# EAGLE design bbqsensor (EAGLE 9.6.2)
COMPANY: ADAFRUIT INDUSTRIES; DRAWN: KTOWN; REV: A
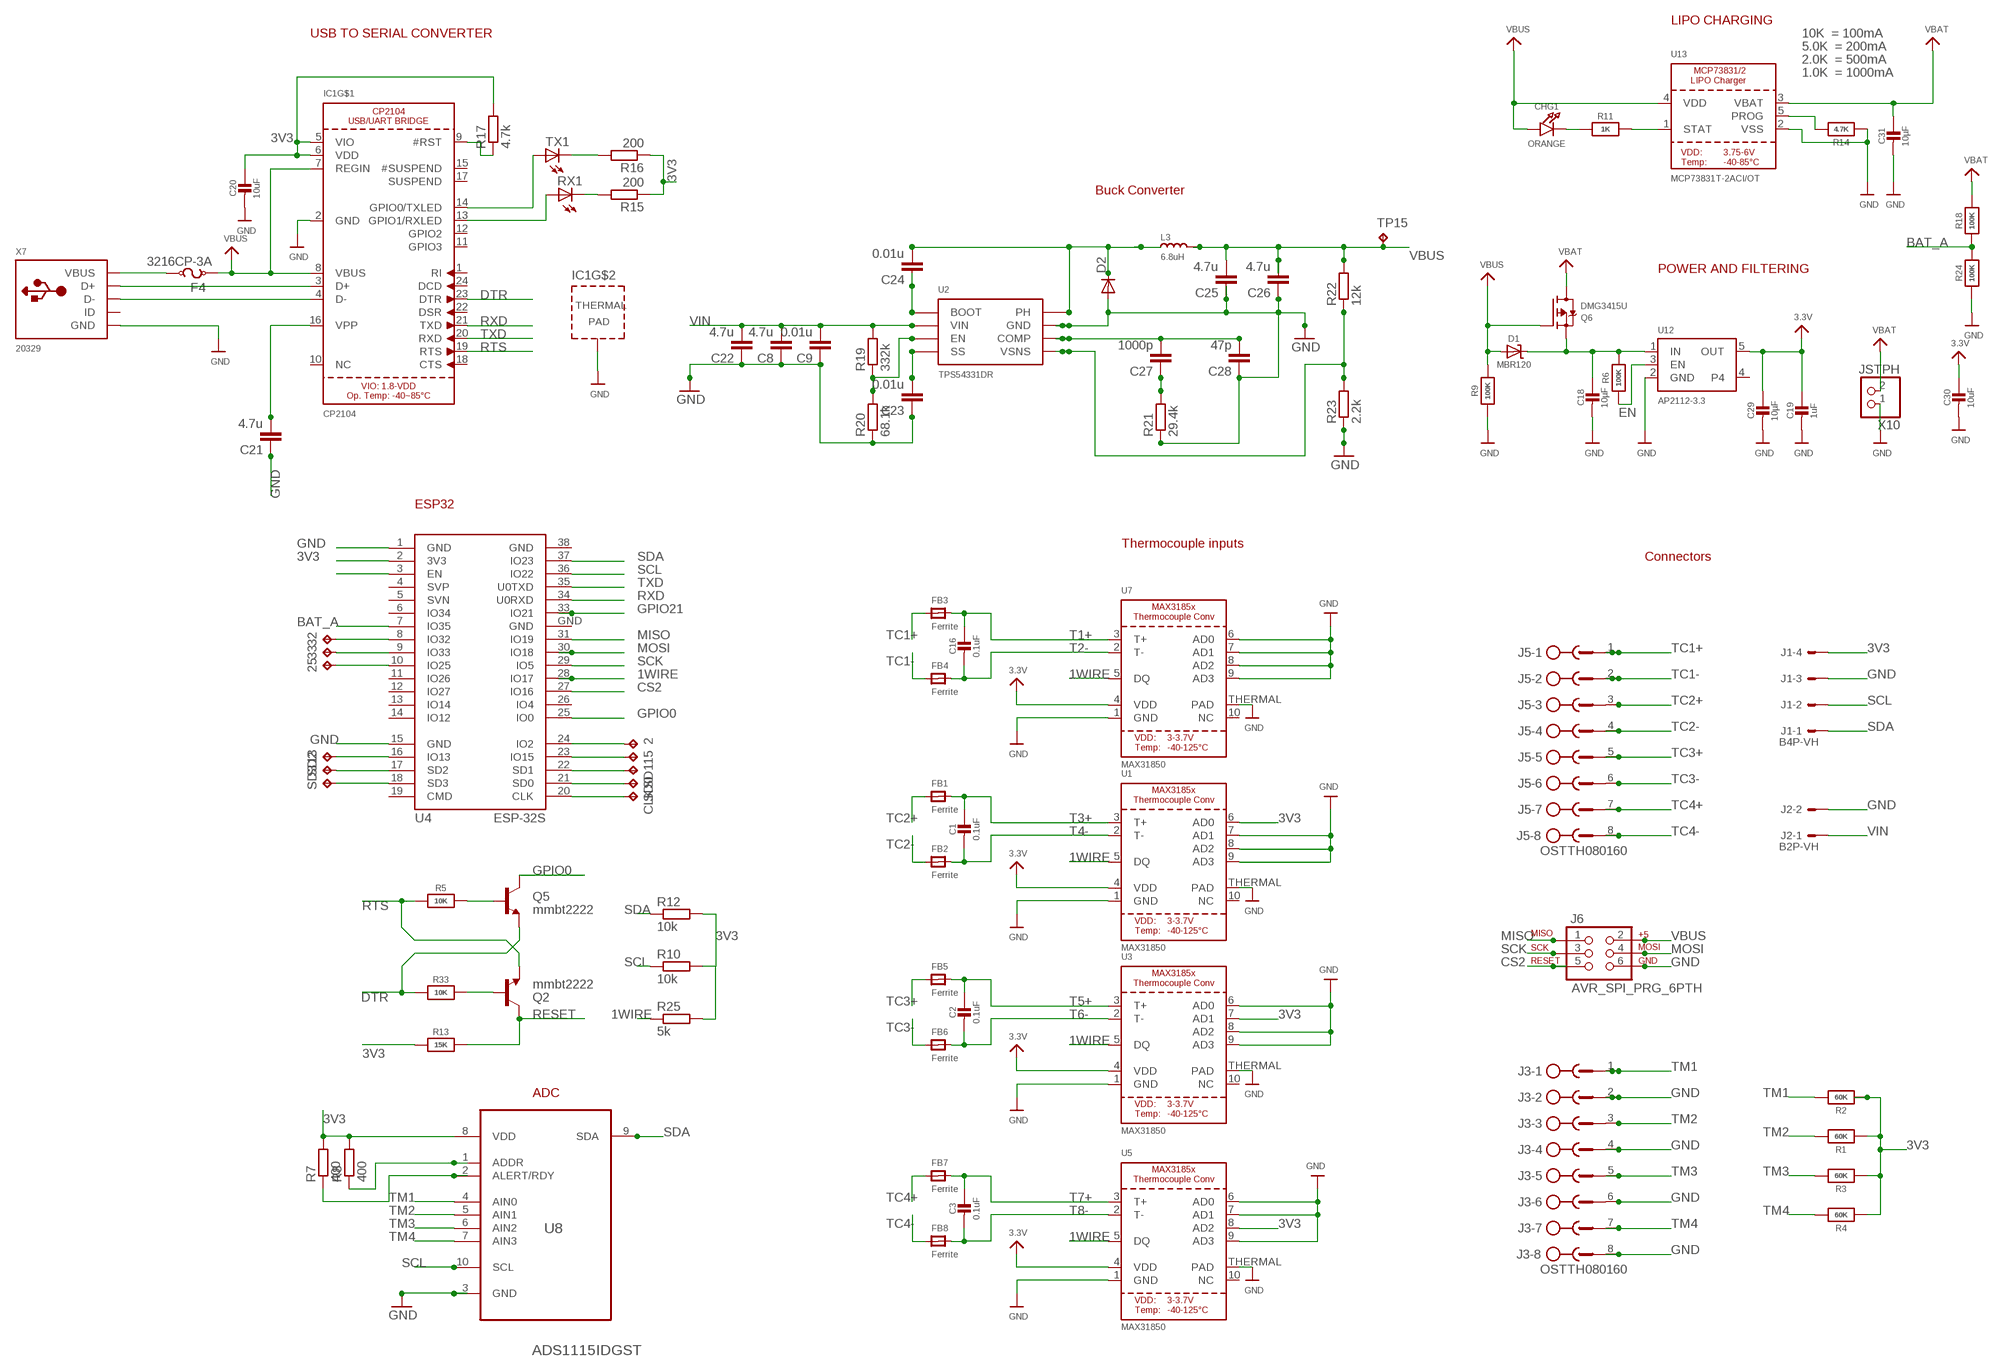
[diagram p0: schematic, sheet 1]

## Parts
2  TPB1,27  [B1,27]
13  TPB1,27  [B1,27]
15  TPB1,27  [B1,27]
25  TPB1,27  [B1,27]
32  TPB1,27  [B1,27]
33  TPB1,27  [B1,27]
C1  0.1uF  CAP_CERAMIC0805-NOOUTLINE  [0805-NO]
C2  0.1uF  CAP_CERAMIC0805-NOOUTLINE  [0805-NO]
C3  0.1uF  CAP_CERAMIC0805-NOOUTLINE  [0805-NO]
C8  4.7u  CC1206  [C1206]
C9  0.01u  CC1206  [C1206]
C16  0.1uF  CAP_CERAMIC0805-NOOUTLINE  [0805-NO]
C18  10µF  CAP_CERAMIC0805-NOOUTLINE  [0805-NO]
C19  1uF  CAP_CERAMIC0603_NO  [0603-NO]
C20  10uF  CAP_CERAMIC0805-NOOUTLINE  [0805-NO]
C21  4.7u  CC1005  [C1005]
C22  4.7u  CC1206  [C1206]
C23  0.01u  CC1206  [C1206]
C24  0.01u  CC1206  [C1206]
C25  4.7u  CC1206  [C1206]
C26  4.7u  CC1206  [C1206]
C27  1000p  CC1206  [C1206]
C28  47p  CC1206  [C1206]
C29  10µF  CAP_CERAMIC0805-NOOUTLINE  [0805-NO]
C30  10uF  CAP_CERAMIC0805-NOOUTLINE  [0805-NO]
C31  10µF  CAP_CERAMIC0805-NOOUTLINE  [0805-NO]
CHG1  ORANGE  LED0805_NOOUTLINE  [CHIPLED_0805_NOOUTLINE]
CLK  TPB1,27  [B1,27]
D1  MBR120  DIODE-SCHOTTKYSOD-123  [SOD-123]
D2  DIODE-DO214AA  [DO214AA]
F4  3216CP-3A  [3216CP-3A]
FB1  Ferrite  FERRITE0805  [0805]
FB2  Ferrite  FERRITE0805  [0805]
FB3  Ferrite  FERRITE0805  [0805]
FB4  Ferrite  FERRITE0805  [0805]
FB5  Ferrite  FERRITE0805  [0805]
FB6  Ferrite  FERRITE0805  [0805]
FB7  Ferrite  FERRITE0805  [0805]
FB8  Ferrite  FERRITE0805  [0805]
IC1  CP2104  [QFN24_4MM_SMSC]
J1  B4P-VH  [B4P]
J2  B2P-VH  [B2P]
J3  OSTTH080160  [EDSTL130-08]
J5  OSTTH080160  [EDSTL130-08]
J6  AVR_SPI_PRG_6PTH  [2X3]
L3  6.8uH  INDUCTOR'1813'  [L1813]
Q2  mmbt2222  TRANSISTOR_NPNSOT23-3  [SOT23-3]
Q5  mmbt2222  TRANSISTOR_NPNSOT23-3  [SOT23-3]
Q6  DMG3415U  MOSFET-P  [SOT23-R]
R1  60K  RESISTOR_0603_NOOUT  [0603-NO]
R2  60K  RESISTOR_0603_NOOUT  [0603-NO]
R3  60K  RESISTOR_0603_NOOUT  [0603-NO]
R4  60K  RESISTOR_0603_NOOUT  [0603-NO]
R5  10K  RESISTOR_0603_NOOUT  [0603-NO]
R6  100K  RESISTOR_0603_NOOUT  [0603-NO]
R7  400  R-EU_R0603  [R0603]
R8  400  R-EU_R0603  [R0603]
R9  100K  RESISTOR_0603_NOOUT  [0603-NO]
R10  10k  R-EU_R0603  [R0603]
R11  1K  RESISTOR_0603_NOOUT  [0603-NO]
R12  10k  R-EU_R0603  [R0603]
R13  15K  RESISTOR_0603_NOOUT  [0603-NO]
R14  4.7K  RESISTOR_0603_NOOUT  [0603-NO]
R15  200  R-EU_R0603  [R0603]
R16  200  R-EU_R0603  [R0603]
R17  4.7k  R-EU_R0603  [R0603]
R18  100K  RESISTOR_0603_NOOUT  [0603-NO]
R19  332k  R-EU_R0603  [R0603]
R20  68.1k  R-EU_R0603  [R0603]
R21  29.4k  R-EU_R0603  [R0603]
R22  12k  R-EU_R0603  [R0603]
R23  2.2k  R-EU_R0603  [R0603]
R24  100K  RESISTOR_0603_NOOUT  [0603-NO]
R25  5k  R-EU_R0603  [R0603]
R33  10K  RESISTOR_0603_NOOUT  [0603-NO]
RX1  LEDSML0805  [SML0805]
SD0  TPB1,27  [B1,27]
SD1  TPB1,27  [B1,27]
SD2  TPB1,27  [B1,27]
SD3  TPB1,27  [B1,27]
TP15  TPB1,27  [B1,27]
TX1  LEDSML0805  [SML0805]
U1  MAX31850  MAX3185X  [TDFN10_3X4MM]
U2  TPS54331DR  [SOIC-8]
U3  MAX31850  MAX3185X  [TDFN10_3X4MM]
U4  ESP-32S  [ESP-32S]
U5  MAX31850  MAX3185X  [TDFN10_3X4MM]
U7  MAX31850  MAX3185X  [TDFN10_3X4MM]
U8  ADS1115IDGST  [SOP50P490X110-10N]
U12  AP2112-3.3  VREG_SOT23-5  [SOT23-5]
U13  MCP73831T-2ACI/OT  MCP73831/2  [SOT23-5]
X7  20329  USB_MICRO_20329_V2  [4UCONN_20329_V2]
X10  JSTPH  CON_JST_PH_2PIN  [JSTPH2]

## Nets
1WIRE: R25.1 U1.5(DQ) U3.5(DQ) U4.28(IO17) U5.5(DQ) U7.5(DQ)
3V3: C19.1 C20.1 C29.1 C30.1 IC1.5(VIO) IC1.6(VDD) J1.4 R1.1 R2.1 R3.1 R4.1 R7.2 R8.2 R10.2 R12.2 R13.1 R15.1 R16.1 R17.2 R25.2 U1.4(VDD) U1.6(AD0) U3.4(VDD) U3.7(AD1) U4.2(3V3) U5.4(VDD) U5.8(AD2) U7.4(VDD) U8.8(VDD) U12.5(OUT) ; supply symbol labelled 3.3V
BAT_A: R18.1 R24.2 U4.7(IO35)
CS2: J6.5 U4.27(IO16)
DTR: IC1.23(DTR) Q5.2(E) R33.1
EN: R6.1 U12.3(EN)
GND: C8.1 C9.1 C18.2 C19.2 C20.2 C21.1 C22.1 C23.1 C25.1 C26.1 C28.1 C29.2 C30.2 C31.2 D2.A IC1.2(GND) IC1.THERM(TP) J1.3 J2.2 J3.2 J3.4 J3.6 J3.8 J6.6 R9.1 R14.1 R20.1 R21.1 R23.1 R24.1 U1.1(GND) U1.7(AD1) U1.8(AD2) U1.9(AD3) U1.THERMAL(PAD) U2.7(GND) U3.1(GND) U3.6(AD0) U3.8(AD2) U3.9(AD3) U3.THERMAL(PAD) U4.1(GND) U4.15(GND) U5.1(GND) U5.6(AD0) U5.7(AD1) U5.9(AD3) U5.THERMAL(PAD) U7.1(GND) U7.6(AD0) U7.7(AD1) U7.8(AD2) U7.9(AD3) U7.THERMAL(PAD) U8.3(GND) U12.2(GND) U13.2(VSS) X7.BASE@1(GND) X7.BASE@2(GND) X7.GND X7.SPRT@1(GND) X7.SPRT@2(GND) X7.SPRT@3(GND) X7.SPRT@4(GND) X10.1
GPIO0: Q5.3(C) U4.25(IO0)
GPIO21: U4.33(IO21)
MISO: J6.1 U4.31(IO19)
MOSI: J6.4 U4.30(IO18)
N$1: 32.TP U4.8(IO32)
N$2: 33.TP U4.9(IO33)
N$3: 25.TP U4.10(IO25)
N$4: 2.TP U4.24(IO2)
N$5: 15.TP U4.23(IO15)
N$6: 13.TP U4.16(IO13)
N$7: SD1.TP U4.22(SD1)
N$8: SD0.TP U4.21(SD0)
N$9: CLK.TP U4.20(CLK)
N$10: SD3.TP U4.18(SD3)
N$11: SD2.TP U4.17(SD2)
N$21: R7.1 U8.2(ALERT/RDY)
N$22: R8.1 U8.1(ADDR)
N$32: IC1.3(D+) X7.D+
N$33: IC1.4(D-) X7.D-
N$34: IC1.13(GPIO1/RXLED) RX1.A
N$35: R15.2 RX1.C
N$36: R16.2 TX1.C
N$37: IC1.14(GPIO0/TXLED) TX1.A
N$40: C18.1 D1.C Q6.2(S) R6.2 U12.1(IN)
N$41: CHG1.C R11.1
N$42: R11.2 U13.1(STAT)
N$43: R14.2 U13.5(PROG)
N$46: C21.2 IC1.16(VPP)
N$47: IC1.9(#RST) R17.1
N$48: F4.2 X7.VBUS
N$49: Q2.1(B) R33.2
N$50: Q5.1(B) R5.2
N$110: C23.2 U2.4(SS)
N$111: R19.1 R20.2 U2.3(EN)
N$112: C24.1 U2.1(BOOT)
N$113: C24.2 D2.C L3.1 U2.8(PH)
N$114: C27.2 C28.2 U2.6(COMP)
N$115: C27.1 R21.2
N$116: R22.1 R23.2 U2.5(VSNS)
RESET: Q2.3(C) R13.2 U4.3(EN)
RTS: IC1.19(RTS) Q2.2(E) R5.1
RXD: IC1.21(TXD) U4.34(U0RXD)
SCK: J6.3 U4.29(IO5)
SCL: J1.2 R10.1 U4.36(IO22) U8.10(SCL)
SDA: J1.1 R12.1 U4.37(IO23) U8.9(SDA)
T1+: C16.1 FB3.2 U7.3(T+)
T2-: C16.2 FB4.2 U7.2(T-)
T3+: C1.1 FB1.2 U1.3(T+)
T4-: C1.2 FB2.2 U1.2(T-)
T5+: C2.1 FB5.2 U3.3(T+)
T6-: C2.2 FB6.2 U3.2(T-)
T7+: C3.1 FB7.2 U5.3(T+)
T8-: C3.2 FB8.2 U5.2(T-)
TC1+: FB3.1 J5.1
TC1-: FB4.1 J5.2
TC2+: FB1.1 J5.3
TC2-: FB2.1 J5.4
TC3+: FB5.1 J5.5
TC3-: FB6.1 J5.6
TC4+: FB7.1 J5.7
TC4-: FB8.1 J5.8
TM1: J3.1 R2.2 U8.4(AIN0)
TM2: J3.3 R1.2 U8.5(AIN1)
TM3: J3.5 R3.2 U8.6(AIN2)
TM4: J3.7 R4.2 U8.7(AIN3)
TXD: IC1.20(RXD) U4.35(U0TXD)
VBAT: C31.1 Q6.3(D) R18.2 U13.3(VBAT) X10.2
VBUS: C25.2 C26.2 CHG1.A D1.A F4.1 IC1.7(REGIN) IC1.8(VBUS) J6.2 L3.2 Q6.1(G) R9.2 R22.2 TP15.TP U13.4(VDD)
VIN: C8.2 C9.2 C22.2 J2.1 R19.2 U2.2(VIN)
Unconnected: IC1.1(RI) IC1.10(NC) IC1.11(GPIO3) IC1.12(GPIO2) IC1.15(#SUSPEND) IC1.17(SUSPEND) IC1.18(CTS) IC1.22(DSR) IC1.24(DCD) U1.10(NC) U3.10(NC) U4.4(SVP) U4.5(SVN) U4.6(IO34) U4.11(IO26) U4.12(IO27) U4.13(IO14) U4.14(IO12) U4.19(CMD) U4.26(IO4) U5.10(NC) U7.10(NC) U12.4 X7.ID

## Notes on the sheet
- LIPO CHARGING
- USB TO SERIAL CONVERTER | 10K  = 100mA
- 5.0K  = 200mA
- 2.0K  = 500mA
- 1.0K  = 1000mA
- Buck Converter
- POWER AND FILTERING
- ESP32
- Thermocouple inputs
- Connectors
- ADC

## Power pins joined to a net without a drawn wire
GND: U4.38(GND) U4.GND

## Library data of the parts
2 13 15 25 32 33 CLK SD0 SD1-SD3 TP15 = testpad:TP: Test pad
C1-C3 C16 C18-C20 C29-C31 = microbuilder:CAP_CERAMIC: Ceramic Capacitors For new designs, use the packages preceded by an '_' character since they are more reliable: The following footprints should be used on most boards: _0402 - Standard footprint for regular board layouts _0603 - Standard footprint for regular board layouts _0805 - Standard footprint for regular board layouts _1206 - Standard footprint for regular board layouts For extremely tight-pitch boards where space is at a premium, the following 'micro-pitch' footprints can be used (smaller pads, no silkscreen outline, etc.): _0402MP - Micro-pitch footprint for very dense/compact boards _0603MP - Micro-pitch footprint for very dense/compact boards _0805MP - Micro-pitch footprint for very dense/compact boards _1206MP - Micro-pitch footprint for very dense/compact boards
C8 C9 C21-C28 = eagle-ltspice:C: CAPACITOR, European symbol; SPICEMODEL: NONE; SPICEPREFIX: C
CHG1 = microbuilder:LED: LED
D1 = microbuilder:DIODE-SCHOTTKY
D2 = diode:DIODE-: DIODE
F4 = fuse:3216CP-3A: SMD FUSE
FB1-FB8 = microbuilder:FERRITE: Ferrite Bead 0603 MMZ1608B121C - 120 Ohm @ 100MHz, 600mA, 0.15 Ohm DC Resistance - Digikey: 445-2164-1-ND BK1608HW121-T - 120 Ohm, 600mA Ferrite Chip - Digikey: 587-1876-2-ND 0805 HZ0805B272R-10 - 2.7K Ohm @ 100MHz, 200mA, 0.8 Ohm DC Resistance - Digikey: 240-2504-1-ND (see also Murata BLM21BD272SN1L) MMZ2012Y152B - 1.5K Ohm @ 100MHz, 500mA, 0.4 Ohm DC Resistance - Digikey: 445-1560-1-ND - Mainly for high frequency (80-400MHz) MMZ2012R102A - 1K Ohm @ 100MHz, 500mA, 0.3 Ohm DC Resistance - Digikey: 445-1555-2-ND - More general purpose (10-200MHz)
IC1 = microbuilder:CP2104: CP2104 - USB to UART Bridge VDD Output: 3.45V
J1 = con-jst:B4P-VH: VH Connector - 0.156"
J2 = con-jst:B2P-VH: VH Connector - 0.156"
J3 J5 = con-ost:OSTTH080160: 5mm Terminal Header
J6 = SparkFun:AVR_SPI_PRG_6: AVR ISP 6 Pin This is the reduced ISP connector for AVR programming. Common on Arduino. This footprint will take up less PCB space and can be used with a 10-pin to 6-pin adapter such as SKU: BOB-08508
L3 = Seeed-OPL-Crystal-Oscillator:INDUCTOR
Q2 Q5 = SparkFun:TRANSISTOR_NPN: Transistor NPN BJT configuration in SOT23 package. MMBT2222 is the common NPN we use. Double check BCE configuration again layout.
Q6 = microbuilder:MOSFET-P: P-Channel Mosfet LEGEND VDS: Voltage Drain-Source ID: Drain Current RDS(ON): Drain-Source On-State Resistance VGS(TH): Gate-Source Threshold Voltage CISS: Drain-Source Input Capacitance SOT-23 Name VDS ID RDS(ON) VGS(TH) CISS Order Number IRLML5103 30V 760mA 600 mOhm -- 75pF @ 25V Digikey: IRLML5103PBFCT-ND IRLML6401 12V 4.3A 50 mOhm 950mV @ 250µA 830pF @ 10V Digikey: IRLML6401PBFTR-ND NTR0202PL 20V 400mA 800 mOhm 2.3V @ 250uA 70pF @ 5V Digikey: NTR0202PLT1GOSTR-ND NTR4101PT1G 20V 1.8A 85 mOhm 1.2V @ 250uA 675pF @ 10V Digikey: NTR4101PT1GOSCT-ND DMP2004K 20V 600mA 900 mOhm 1V @ 250uA 175pF @ 16V Digikey: DMP2004KDICT-ND PMV65XP 20V 3.9A 76 mOhm 950mV @ 1mA 725pF @ 20V Digikey: 568-2358-2-ND TO-252 Name VDS ID RDS(ON) VGS(TH) CISS Order Number AOD417 30V 25A 34 mOhm 3V @ 250µA 920pF @ 15V Digikey: 785-1106-2-ND PowerPak Name VDS ID RDS(ON) VGS(TH) CISS Order Number AON7401 30V 12A 14 mOhm 3V @ 250µA 2600pF @ 15V Digikey: 785-1302-1-ND
R1-R6 R9 R11 R13 R14 R18 R24 R33 = microbuilder:RESISTOR: Resistors For new designs, use the packages preceded by an '_' character since they are more reliable: The following footprints should be used on most boards: _0402 - Standard footprint for regular board layouts _0603 - Standard footprint for regular board layouts _0805 - Standard footprint for regular board layouts _1206 - Standard footprint for regular board layouts For extremely tight-pitch boards where space is at a premium, the following 'micro-pitch' footprints can be used (smaller pads, no silkscreen outline, etc.): _0402MP - Micro-pitch footprint for very dense/compact boards _0603MP - Micro-pitch footprint for very dense/compact boards _0805MP - Micro-pitch footprint for very dense/compact boards _1206MP - Micro-pitch footprint for very dense/compact boards
R7 R8 R17 R19-R23 = resistor:R-EU_: RESISTOR, European symbol
R10 R12 R15 R16 R25 = rcl:R-EU_: RESISTOR, European symbol
RX1 TX1 = led:LED: LED
U1 U3 U5 U7 = microbuilder:MAX3185X: MAX31850/MAX31851 One-Wire Thermocouple to Digital Converter
U2 = Volks73-TexasInstruments:TPS54331*: DC-DC Converter 3-A, 28-V, Step-Down DC-DC Converter with Eco-Mode™ Documentation Datasheet <http://www.ti.com/lit/ds/symlink/tps54331.pdf> Description The TPS54331 device is a 28-V, 3-A non-synchronous buck converter that integrates a low RDS(on) high-side MOSFET. To increase efficiency at light loads, a pulse skipping Eco-mode feature is automatically activated. Furthermore, the 1-uA shutdown supply current allows the device to be used in battery powered applications. Current mode control with internal slope compensation simplifies the external compensation calculations and reduces component count while allowing the use of ceramic output capacitors. A resistor divider programs the hysteresis of the input under-voltage lockout. An overvoltage transient protection circuit limits voltage overshoots during startup and transient conditions. A cycle-by-cycle current-limit scheme, frequency fold back, and thermal shutdown protect the device and the load in the event of an overload condition. The TPS54331 device is available in 8-pin SOIC package and 8-pin SO PowerPAD package that has been internally optimized to improve thermal performance. Features 3.5 to 28-V Input Voltage Range Adjustable Output Voltage Down to 0.8V Integrated 80-mΩ High-Side MOSFET Supports up to 3-A Continuous Output Current High Efficiency at Light Loads with a Pulse Skipping Eco-mode™ Fixed 1MHz Switching Frequency Typical 1uA Shutdown Quiescent Current Adjustable Slow Start Limits Inrush Currents Programmable UVLO Threshold Overvoltage Transient Protection Cycle-by-Cycle Current-Limit, Frequency Fold Back, and Thermal Shutdown Protection Available in Easy-to-Use SOIC8 Package or Thermally Enhanced 8-Pin SOIC PowerPAD™ Package Supported by WEBENCH <http://www.ti.com/lsds/ti/analog/webench/overview.page>™ Tool (http://www.ti.com/lsds/ti/analog/webench/overview.page) Applications Consumer Applications such as Set-Top Boxes, CPE Equipment, LCB Displays, Peripherals, and Battery Chargers Industrial and Car Audio Power Supplies 5-V, 12-V and 24-V Distributed Power Systems; CATEGORY: Integrated Circuits (ICs); CURRENT-OUTPUT: 3A; DESCRIPTION: IC REG BUCK ADJ 3A 8SOIC; DOCUMENTATION_LINK: <a href="http://www.ti.com/lit/ds/symlink/tps54331.pdf">Datasheet</a>; DOCUMENTATION_URL: http://www.ti.com/lit/ds/symlink/tps54331.pdf; FAMILY: PMIC - Voltage Regulators - DC DC Switching Regulators; FREQUENCY-SWITCHING: 570kHz; MANUFACTURER: Texas Instruments; MOUNTING_TYPE: Surface Mount; NUMBER_OF_OUTPUTS: 1; OPERATING_TEMPERATURE: -40C ~ 150C; OUTPUT_TYPE: Adjustable; PACKAGE: 8-SOIC (0.154", 3.90mm Width); PART_NUMBER: TPS54331DR; SEIRES: Swift, Eco-Mode; SUPPLIER_DEVICE_PACKAGE: 8-SOIC; SUPPLIER_ITEM_LINK: <a href="http://www.digikey.com/product-detail/en/TPS54331DR/296-26991-1-ND/2255284">Details</a>; SUPPLIER_ITEM_NUMBER: 296-26991-1-ND; SUPPLIER_ITEM_URL: http://www.digikey.com/product-detail/en/TPS54331DR/296-26991-1-ND/2255284; SUPPLIER_LINK: <a href="http://www.digikey.com">Home Page</a>; SUPPLIER_NAME: Digi-Key; SUPPLIER_URL: http://www.digikey.com; SYNCHRONOUS_RECTIFIER: No; TYPE: Step-Down (Buck); VOLTAGE-INPUT: 3.5V ~ 28V; VOLTAGE-OUTPUT: 0.8V ~ 25V
U4 = esp32:ESP-32S: Ai-Thinker ESP-32S
U8 = Texas Instruments_By_element14_Batch_1:ADS1115IDGST: Analog-to-Digital Converter with Internal Reference; MPN: ADS1115IDGST; OC_FARNELL: 1762981; OC_NEWARK: 25R1241; PACKAGE: MSOP-10; SUPPLIER: Texas Instruments
U12 = microbuilder:VREG_SOT23-5: SOT23-5 Fixed Voltage Regulators Part Current Out V Out V In V Dropout θJA (°C/W) TJ (°C) Digikey Part No. ADP121 150mA 3.3V 3.4-5.5V 0.09V @ 150mA -- -- ADP121-AUJZ33R7CT-ND ADP121 150mA 3.0V 3.1-5.5V 0.09V @ 150mA -- -- ADP121-AUJZ30R7CT-ND ADP122 300mA 3.3V 3.4-5.5V 0.085V @ 300mA -- -- ADP122AUJZ-3.3-R7CT-ND ADP1712 300mA 3.3V 3.5-5.5V 0.17V @ 300mA -- -- ADP1712AUJZ-3.3-R7TR-ND AP7311 (Low Cost) 150mA 3.3V 3.5-6V 0.15V @ 150mA -- -- AP7311-33WG-7DICT-ND LD39015M18R 150mA 1.8V 1.9V-5.5V 0.08V @ 100mA -- -- 497-6977-1-ND LP2985A-33DBVR 150mA 3.3V 3.3-16V 0.28V @ 150mA 206 150 296-18479-1-ND MCP1824T-3302E/OT 300mA 3.3V 3.5V-6V 0.2V @ 300mA -- -- MCP1824T-3302E/OTCT-ND MIC5205-2.5YM5 TR 150mA 2.5V 2.7-16V 0.165V @ 150mA -- -- 576-1257-2-ND MIC5205-3.0YM5 TR 150mA 3.0V 3.2V-16V 0.165V @ 150mA -- -- 576-1258-2-ND MIC5205-3.3YM5 TR 150mA 3.3V 3.5V-16V 0.165V @ 150mA -- -- 576-1259-2-ND TPS780330220 150mA 3.3V+2.2V 3.6-5.5V 250mV Max -- -- 296-23332-1-ND TDA3663/N1,135 100mA 3.3V 3.5-45V 0.18V @ 50mA -- -- 568-5343-1-ND Max operating temp can be calculated using θJA, TJ (max junction temperature), and power in watts. Set the "Maximum Ambient Temperature" until it reaches TJ ("Max Junction Temperature"), which is the absolute limit for safe use of the regulator: Heat Sink Temperature Calculator <http://www.daycounter.com/Calculators/Heat-Sink-Temperature-Calculator.phtml> For example, With 12V source into a 3.3V LP2985 and a 30mA load, we are dissipating (12V-3.3V) * 0.03A = 0.261W. With a θJA of 206 °C/W, a TJ of 150°C, and 261mW we can safely use the chip without a heat sink up to 75°C (=147.1°C Junction Temperature).
U13 = microbuilder:MCP73831/2: MCP73831/2 LIPO Charger VDD: 3.75 - 6V Temp -40 - 85°C Programmable Charge Rate: 15-500mA NOTE: STAT is a tri-state logic output on the MCP73831 and an open-drain output on the MCP73832. SOT23-5 with 4.2V output and tri-state logic on STAT = MCP73831T-2ACI/OT
X7 = microbuilder:USB: USB Connectors USBMINIB - Surface Mount Female Mini-B USB Connector 4UConnector: 06564
X10 = microbuilder:CON_JST_PH_2PIN: JST 2-Pin Right-Angle Connector PH-Series - 4UConnector: 17311 SH-Series - 4UConnector: 07278

## Net classes
1 gnd: width 0.635 mm, drill 0.635 mm, clearance 0.254 mm
2 vcc: width 0.406 mm, drill 0.406 mm, clearance 0.254 mm

## Board
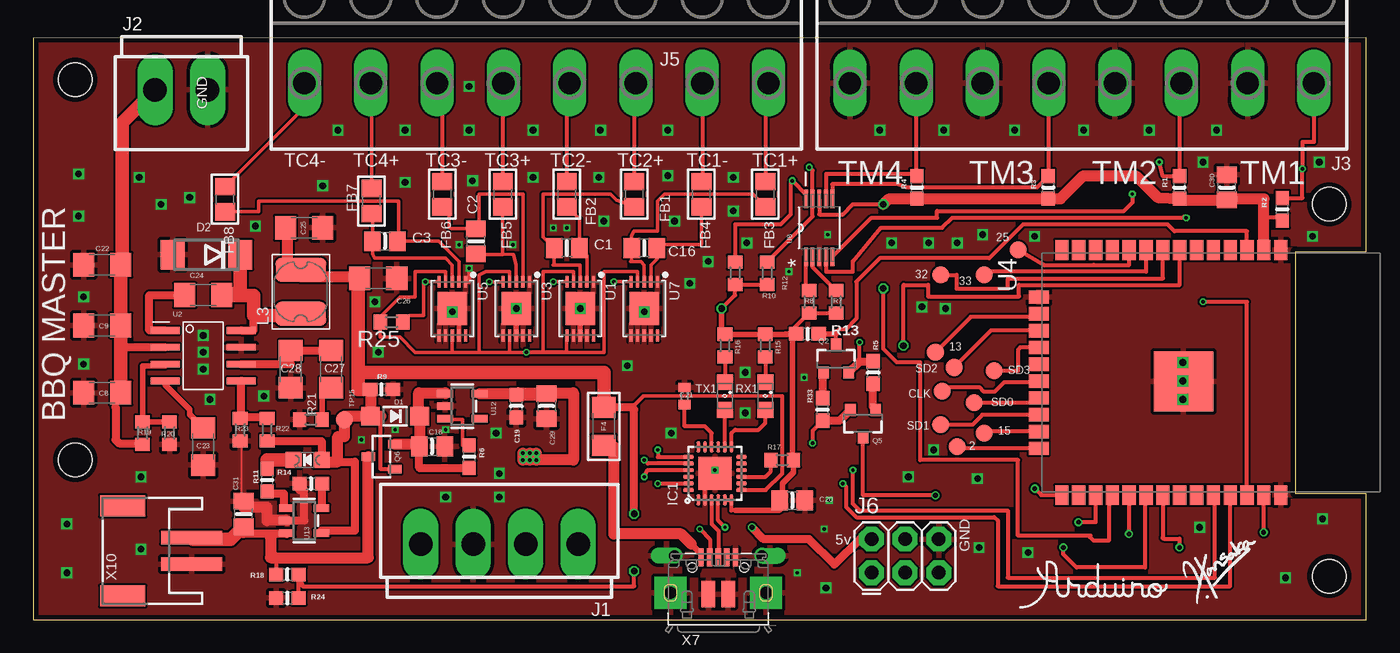
[diagram p1: board, top side]
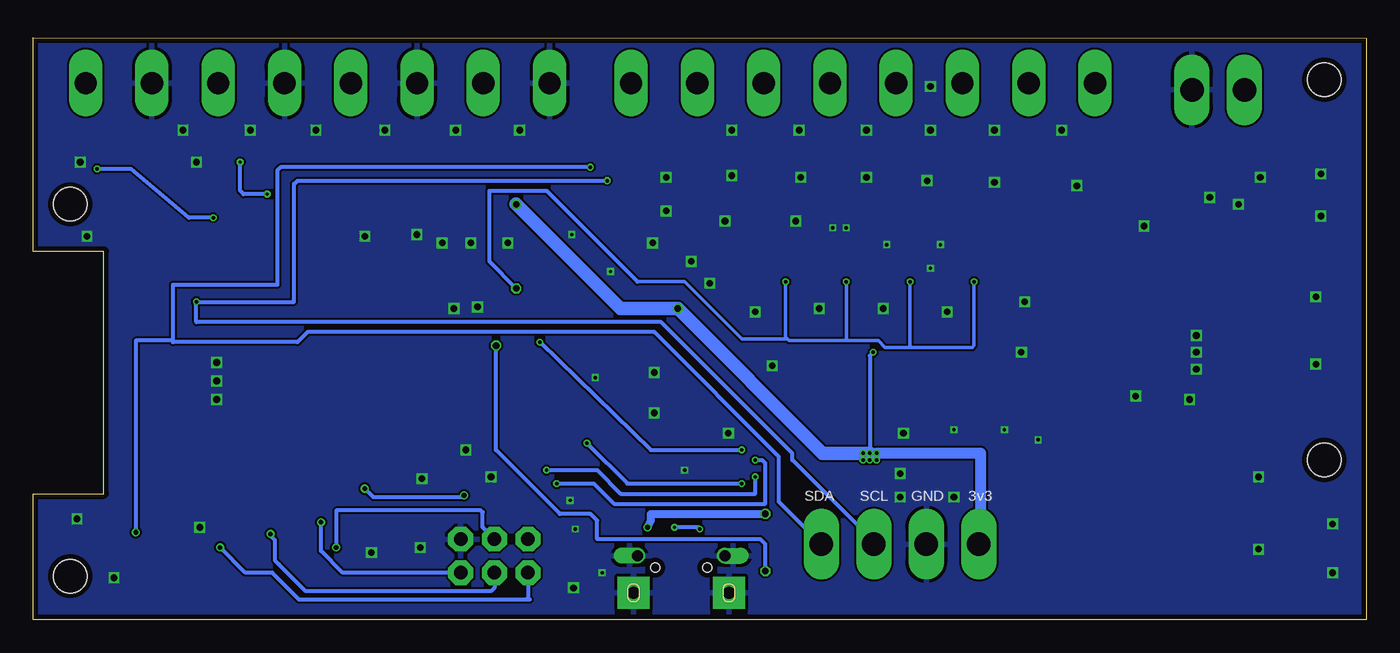
[diagram p2: board, bottom side, seen from below]

Size 100.58 x 43.93 mm. Coordinates in mm from the lower left corner, seen from the top.
Outline: 0,0 100.58,0 100.58,9.53 95.25,9.53 95.25,27.81 100.58,27.81 100.58,43.93 0,43.92 0,0
Copper layers (1*16): Top 0.035559375mm / dielectric 1.6mm / Bottom 0.035559375mm
Design rules "oshpark-2layer *": minimum track width 6mil, minimum drill 10mil, track to track 6mil, track to pad 6mil, pad to pad 6mil, via to via 6mil, smd to smd 6mil, copper to edge 15mil, drill to drill 6mil, minimum pad ring 5mil, minimum via ring 5mil, stop-mask expansion 2.5mil, vias tented up to drill 11mil, thermal gap 10mil
Holes 2.54 mm at 3.17,40.77 3.17,12.07 97.79,3.3 97.79,31.37

### Footprints (pad centres in the part's own frame; a part is rotated, then mirrored left to right if it is on the bottom)
B1,27 = smd 1.27 x 1.27: TP 0,0
0805-NO = smd 1.24 x 1.5: 1 -0.95,0; 2 0.95,0
C1206 = smd 1.6 x 1.8: 1 -1.4,0; 2 1.4,0
0603-NO = smd 1.075 x 1: 1 -0.85,0; 2 0.85,0
C1005 = smd 0.7 x 0.9: 1 -0.65,0; 2 0.65,0
CHIPLED_0805_NOOUTLINE = smd 1.2 x 1.2: A 0,-1.05; C 0,1.05
SOD-123 = smd 1.4 x 1.4: A 1.85,0; C -1.85,0
DO214AA = smd 1.8 x 2.2: A 2.55,0; C -2.55,0
3216CP-3A = smd 1.6 x 1.803: 1 -1.429,0; 2 1.429,0
0805 = smd 1.3 x 1.5: 1 -0.95,0; 2 0.95,0
QFN24_4MM_SMSC = smd 0.8 x 0.28: 1 -2,1.25; 2 -2,0.75; 3 -2,0.25; 4 -2,-0.25; 5 -2,-0.75; 6 -2,-1.25; 13 2,-1.25; 14 2,-0.75; 15 2,-0.25; 16 2,0.25; 17 2,0.75; 18 2,1.25 | smd 0.28 x 0.8: 7 -1.25,-2; 8 -0.75,-2; 9 -0.25,-2; 10 0.25,-2; 11 0.75,-2; 12 1.25,-2; 19 1.25,2; 20 0.75,2; 21 0.25,2; 22 -0.25,2; 23 -0.75,2; 24 -1.25,2 | smd 2.5 x 2.5: THERM 0,0
B4P = drill 1.778 long: 1 -5.944,0; 2 -1.981,0; 3 1.981,0; 4 5.944,0
B2P = drill 1.778 long: 1 -1.981,0; 2 1.981,0
EDSTL130-08 = drill 1.676 long: 1 -17.5,0; 2 -12.5,0; 3 -7.5,0; 4 -2.5,0; 5 2.5,0; 6 7.5,0; 7 12.5,0; 8 17.5,0
2X3 = drill 1.016 pad 1.88 octagon: 1 0,0; 2 0,2.54; 3 2.54,0; 4 2.54,2.54; 5 5.08,0; 6 5.08,2.54
L1813 = smd 1.778 x 3.81: 1 -1.651,0; 2 1.651,0
SOT23-3 = smd 0.8 x 0.9: 1 -0.95,-1; 2 0.95,-1; 3 0,1.1
SOT23-R = smd 0.635 x 1.016: 1 -0.95,-1; 2 0.95,-1; 3 0,1
R0603 = smd 1 x 1.1: 1 -0.85,0; 2 0.85,0
SML0805 = smd 1.2 x 1.2: A 1.05,0; C -1.05,0
TDFN10_3X4MM = smd 0.25 x 0.9: 1 -1,-2.02; 2 -0.5,-2.02; 3 0,-2.02; 4 0.5,-2.02; 5 1,-2.02; 6 1,2.02; 7 0.5,2.02; 8 0,2.02; 9 -0.5,2.02; 10 -1,2.02 | smd 2.25 x 2.5: THERMAL 0,0
SOIC-8 = smd 0.5 x 2.2: 1 -1.905,-2.875; 2 -0.635,-2.875; 3 0.635,-2.875; 4 1.905,-2.875; 5 1.905,2.875; 6 0.635,2.875; 7 -0.635,2.875; 8 -1.905,2.875
ESP-32S = smd 1.5 x 1: 1 -9.25,7; 2 -9.25,5.73; 3 -9.25,4.46; 4 -9.25,3.19; 5 -9.25,1.92; 6 -9.25,0.65; 7 -9.25,-0.62; 8 -9.25,-1.89; 9 -9.25,-3.16; 10 -9.25,-4.43; 11 -9.25,-5.7; 12 -9.25,-6.97; 13 -9.25,-8.24; 14 -9.25,-9.51; 25 9.25,-9.51; 26 9.25,-8.24; 27 9.25,-6.97; 28 9.25,-5.7; 29 9.25,-4.43; 30 9.25,-3.16; 31 9.25,-1.89; 32 9.25,-0.62; 33 9.25,0.65; 34 9.25,1.92; 35 9.25,3.19; 36 9.25,4.46; 37 9.25,5.73; 38 9.25,7 | smd 1 x 1.5: 15 -5.7,-11.25; 16 -4.43,-11.25; 17 -3.16,-11.25; 18 -1.89,-11.25; 19 -0.62,-11.25; 20 0.65,-11.25; 21 1.92,-11.25; 22 3.19,-11.25; 23 4.46,-11.25; 24 5.73,-11.25 | smd 4.5 x 4.5: GND 0.68,-0.33
SOP50P490X110-10N = smd 1.422 x 0.279: 1 -2.184,0.991; 2 -2.184,0.508; 3 -2.184,0; 4 -2.184,-0.508; 5 -2.184,-0.991; 6 2.184,-0.991; 7 2.184,-0.508; 8 2.184,0; 9 2.184,0.508; 10 2.184,0.991
SOT23-5 = smd 0.55 x 1.2: 1 -0.95,-1.3; 2 0,-1.3; 3 0.95,-1.3; 4 0.95,1.3; 5 -0.95,1.3
4UCONN_20329_V2 = smd 1 x 2: BASE@1 -0.75,-2; BASE@2 0.75,-2 | smd 0.4 x 1.35: D+ 0,0.775; D- -0.65,0.775; GND 1.3,0.775; ID 0.65,0.775; VBUS -1.3,0.775 | drill 0.8 pad 1.143 offset: SPRT@1 -3.3,0.9; SPRT@2 3.3,0.9 | drill 0.9 pad 2.413 square: SPRT@3 -3.6,-1.9; SPRT@4 3.6,-1.9 | hole 0.7: -1.95,0; 1.95,0
JSTPH2 = smd 1 x 4.6: 1 -1,-3.7; 2 1,-3.7 | smd 1.6 x 3.4: NC1 -3.4,1.5; NC2 3.4,1.5

### Placement (x,y rotation side)
2  69.72,13.08 0 top
13  68.07,20.19 0 top
15  71.75,14.1 0 top
25  74.3,27.94 0 top
32  68.45,26.04 0 top
33  71.75,26.04 0 top
C1  40.26,28.07 0 top
C2  33.4,28.58 90 top
C3  26.54,28.58 0 top
C8  5.21,17.15 0 top
C9  5.21,22.23 0 top
C16  46.1,28.07 0 top
C18  30.1,13.08 0 top
C19  36.45,16.13 270 top
C20  57.28,9.02 0 top
C21  49.15,16.89 270 top
C22  5.21,26.8 0 top
C23  12.83,13.08 90 top
C24  12.83,24.51 0 top
C25  20.45,29.59 180 top
C26  26.04,25.78 180 top
C27  22.48,18.92 90 top
C28  19.43,18.92 90 top
C29  38.73,16.13 270 top
C30  90.04,32.64 90 top
C31  15.88,8 90 top
CHG1  20.7,12.07 90 top
CLK  68.58,17.27 0 top
D1  27.3,15.37 180 top
D2  13.08,27.56 180 top
F4  43.05,14.61 270 top
FB1  45.34,32.13 270 top
FB2  40.26,32.13 270 top
FB3  55.24,32.13 270 top
FB4  50.42,32.13 270 top
FB5  35.43,32.13 270 top
FB6  30.86,32.13 270 top
FB7  25.53,31.62 270 top
FB8  14.48,31.75 270 top
IC1  51.44,11.05 90 top
J1  35.18,5.72 180 top
J2  11.18,40 0 top
J3  79.12,40.51 180 top
J5  37.97,40.51 180 top
J6  63.25,3.56 0 top
L3  20.19,24.77 90 top
Q2  60.58,19.69 0 top
Q5  62.61,14.86 180 top
Q6  26.29,12.32 90 top
R1  86.49,32.64 90 top
R2  94.23,30.99 90 top
R3  76.58,32.64 90 top
R4  66.67,32.64 90 top
R5  63.37,18.67 270 top
R6  32.89,12.32 270 top
R7  60.58,24 270 top
R8  58.55,24 270 top
R9  26.29,17.4 180 top
R10  52.96,26.16 270 top
R11  17.65,10.54 270 top
R12  55.37,26.16 270 top
R13  58.42,21.59 0 top
R14  20.96,10.29 0 top
R15  55.24,20.7 270 top
R16  52.2,20.7 270 top
R17  56.52,12.07 0 top
R18  19.18,3.43 180 top
R19  8.26,14.1 270 top
R20  10.29,14.1 90 top
R21  20.96,15.11 0 top
R22  17.65,14.35 270 top
R23  15.62,14.35 90 top
R24  19.18,1.65 0 top
R25  27.05,22.48 180 top
R33  59.56,15.88 90 top
RX1  55.24,16.89 270 top
SD0  70.99,16.38 0 top
SD1  68.45,14.73 0 top
SD2  69.47,19.05 0 top
SD3  72.52,18.8 0 top
TP15  23.5,15.11 0 top
TX1  52.2,16.89 270 top
U1  41.27,23.5 180 top
U2  12.83,19.94 270 top
U3  36.45,23.5 180 top
U4  87.12,18.67 270 top
U5  31.62,23.5 180 top
U7  46.1,23.5 180 top
U8  59.31,29.59 90 top
U12  32.38,16.13 270 top
U13  20.45,7.49 270 top
U$5  [SIGNATURE]  86.61,0 0 top
U$6  [LOGO-A]  75.06,2.79 0 top
X7  51.69,3.94 0 top
X10  8.26,5.21 90 top

### Tracks (layer width: path | path; a pad name or v marks a point on that pad's centre or on a via)
1WIRE  (via drill 0.25 pad 0.25, 0.5 pad 0.25)
  Top 0.254: U5.5 30.61,25.53 v29.59,25.53 29.46,25.4 29.46,22.99 28.41,22.99 R25.1 | v34.42,25.53 34.43,25.52 U3.5 | U1.5 40.26,25.53 v39.24,25.53 | U7.5 45.09,25.53 v43.81,25.53
  Top 0.305: v64.13,25.02 64.13,20.45 65.15,19.43 66.93,19.43 66.93,12.07 74.3,12.07 74.3,6.35 79.63,6.35 | 81.7,9.42 U4.28 arc90 81.15,9.15 81.15,5.97 80.01,5.97 79.63,6.35 | 79.78,6.35 79.76,6.35 79.63,6.35
  Bottom 0.254: 34.42,20.57 29.72,20.57 29.59,20.7 v29.59,25.53 | 34.42,25.27 v34.42,25.53 | 34.42,21.22 34.42,25.27 | 34.42,20.57 34.42,21.84 34.42,25.27 | 34.42,20.57 36.32,20.57 36.83,21.08 39.24,21.08 | 39.24,21.08 v39.24,25.53 | 39.24,21.08 43.56,21.08 43.69,21.21 | 43.69,21.21 43.81,21.34 v43.81,25.53 | 43.69,21.21 47.12,21.21 51.44,25.53 54.99,25.53
  Bottom 0.305: v64.13,25.02 66.17,27.05 66.17,32.39 61.85,32.39 54.99,25.53
3V3  (via drill 0.25 pad 0.25, 0.5 pad 0.25)
  Top 0.254: U3.4 35.94,25.52 35.94,26.29 34.16,26.29 33.66,26.04 33.66,20.19 | 33.66,20.19 35.94,20.19 | 35.94,20.19 35.95,20.2 U3.7 | U1.6 40.26,21.46 40.26,20.19 | 40.26,20.19 38.48,20.19 | 38.48,20.19 v37.21,20.19 35.94,20.19 | U1.4 40.77,26.29 38.48,26.29 38.48,20.19 | U7.4 45.59,26.29 43.05,26.29 43.05,20.19 40.26,20.19 | 33.66,20.19 31.62,20.19 | 31.62,20.19 U5.8 | U5.4 31.12,26.29 28.83,26.29 28.83,24.38 27.69,24.38 26.2,22.9 R25.2 26.16,22.44 26.16,21.34 27.69,21.34 28.83,20.19 31.62,20.19
  Top 0.305: 40.26,20.19 v37.21,20.19 | R7.2 R8.2 57.19,21.8 57.19,21.55 | U8.8 59.31,30.61 61.09,30.61 61.85,31.37 v64.13,31.37 | IC1.5 IC1.6 52.69,8.26 52.98,8.26 | R12.2 R10.2 52.96,24.51 v51.94,23.5 | R2.1 94.23,30.35 92.85,30.35
  Top 0.406: 52.98,8.26 56.26,8.26 56.33,8.32 C20.1 56.52,9.21 56.52,10.29 57.37,11.14 R17.2 57.28,12.15 57.28,21.46 57.19,21.55 56.77,21.55 | 56.77,21.55 R15.1 R16.1 51.94,21.8 v51.94,23.5 | R13.1 56.77,21.59 56.77,21.55
  Top 0.813: U12.5 36.45,17.08 C19.1 | C19.1 38.73,16.98 C29.1 | C19.1 36.62,17.15 40.77,17.15 40.77,12.07 v37.97,12.07 | v37.97,12.07 v37.47,12.07 | v37.97,12.07 v36.96,12.07 | v36.96,12.07 v36.96,12.57 | v36.96,12.07 v37.47,12.57 v37.97,12.57 | v64.13,31.37 64.52,31.75 66.67,31.75 R4.1 R3.1 77.51,31.79 79.25,33.53 83.19,33.53 84.84,31.88 R1.1 86.84,31.69 C30.1 90.4,31.79 92.85,31.79 92.85,30.35 U4.2
  Bottom 0.305: v37.21,20.19 37.47,19.94 v37.47,12.57
  Bottom 0.813: J1.4 29.08,5.87 29.08,12.57 v36.96,12.57
  Bottom 1.016: v37.47,12.57 41.02,12.57 v51.94,23.5 56.26,23.5 v64.13,31.37
BAT_A  (via drill 0.5 pad 0.25)
  Top 0.305: R24.2 R18.1 20.32,2.54 45.34,2.54 v45.34,3.68 | v65.66,20.7 65.66,25.27 67.51,25.27 67.51,24.42 74.38,24.42 74.38,25.27 86.5,25.27 U4.7
  Bottom 0.305: v65.66,20.7 65.66,12.83 60.83,8 58.55,8 58.04,7.49 58.04,6.1 45.72,6.1 45.34,5.72 v45.34,3.68
CS2  (via drill 0.35)
  Top 0.305: v78.87,7.37 80.15,7.37 U4.27
  Bottom 0.305: J6.5 77.22,3.56 78.87,5.21 v78.87,7.37
DTR  (via drill 0.25 pad 0.25)
  Top 0.305: R33.1 58.8,14.26 v58.8,13.34 | v47.12,10.29 47.13,10.3 IC1.23
  Top 0.61: Q5.2 60.83,15.03 R33.1
  Bottom 0.305: v58.8,13.34 55.75,10.29 v47.12,10.29
EN
  Top 0.254: R6.1 32.38,13.17 32.38,15.11 31.09,15.11 U12.3
GND  (via drill 0.25 pad 0.41, 0.5 pad 0.81)
  Top 0.152: R23.1 15.75,13.37 15.75,9.08 C31.2 | 21.78,29.72 C25.1
  Top 0.305: U5.9 32.12,23.24 v31.62,23.24 | v32.89,26.54 32.89,25.52 U5.1 | IC1.2 50.69,10.29 50.67,10.29 50.67,11.05 IC1.THERM
  Top 0.406: U1.8 U1.THERMAL | U3.8 U3.THERMAL
  Top 0.61: U13.2 20.45,7.49 20.45,9.78 20.11,9.78 R14.1
  Top 0.813: U13.2 17.65,7.49 17.65,8.51 15.88,8.51 C31.2
  other vias: 3.43,33.66 3.43,30.48 3.81,24.38 3.81,19.3 2.54,7.24 2.54,3.56 8.13,5.33 8.13,10.8 12.83,20.19 36.45,23.5 25.78,24 41.27,23.5 46.1,23.24 52.83,30.86 49.53,25.4 47.88,33.53 42.67,33.4 37.72,33.4 33.15,33.15 28.07,33.02 42.8,36.96 37.72,36.96 32.89,36.96 28.07,36.96 47.88,36.96 52.83,33.4 50.93,27.05 44.83,19.18 35.18,9.27 31.12,9.27 48.13,14.1 53.72,18.67 53.72,15.62 68.83,23.5 69.72,28.45 88.01,6.98 97.28,7.62 94.49,3.18 75.06,5.08 43.05,30.1 48.39,30.1 71.63,29.08 67.56,28.45 9.65,31.37 11.81,31.88 8,33.4 22.99,36.96 21.84,32.77 32.89,40.26 68.71,36.96 74.04,36.96 79.25,36.96 84.2,36.96 89.28,36.96 63.88,36.96 71.25,10.67 35.18,11.05 12.83,18.92 12.83,21.46 16.76,29.72 13.34,16.64 17.4,16.89 26.04,20.19 34.92,14.1 31.12,14.35 32.13,28.32 36.2,28.32 39.24,29.59 40.26,29.59 51.44,11.3 57.66,3.56 60.07,9.02 27.3,14.35 24.77,13.59 59.69,6.86 86.74,19.43 67.95,12.83 86.74,16.64 86.74,18.03 67.06,23.62 97.03,34.54 96.52,28.96 66.04,10.8 88.27,34.54 64.77,28.45 53.85,28.45 75.56,28.96 59.94,29.08 57.02,26.29 58.17,18.29 71.37,5.46 59.82,2.41
  pour Top: 102.11,44.07 102.11,0.13 -0.2,0.13 0,44.2
  pour Bottom: 102.11,44.2 102.11,-0.13 0,-0.13 0,44.2
GPIO0  (via drill 0.35)
  Top 0.305: Q5.3 62.61,9.4 v68.07,9.4 | 77.46,9.27 U4.25 76.05,9.42 v75.56,9.91
  Bottom 0.305: v68.07,9.4 68.2,9.27 74.93,9.27 v75.56,9.91
MISO  (via drill 0.35)
  Top 0.305: v86.49,5.46 86.49,6.13 85.31,6.13 arc-90 85.22,6.22 85.22,9.4 arc-90 U4.31
  Bottom 0.305: J6.1 63.25,1.65 63.12,1.52 80.52,1.52 82.55,3.56 84.58,3.56 v86.49,5.46
MOSI  (via drill 0.35)
  Top 0.305: U4.30 arc90 83.88,9.34 83.88,3.97 78.71,3.97 77.72,4.95 v77.72,5.46
  Bottom 0.305: v77.72,5.46 77.72,8.26 66.8,8.26 66.67,8.13 66.67,6.98 J6.4
N$1
  Top 0.305: 68.83,25.65 32.TP 69.67,26.04 69.67,25.01 73.55,25.01 73.55,25.78 85.23,25.78 U4.8
N$2
  Top 0.305: U4.9 83.96,26.29 72.01,26.29 33.TP
N$3
  Top 0.305: 25.TP 76.27,26.8 80.01,26.8 82.69,26.8 U4.10
N$4
  Top 0.305: U4.24 69.86,12.94 2.TP
N$5
  Top 0.305: U4.23 71.87,14.21 15.TP
N$6
  Top 0.305: U4.16 75.87,22.86 70.74,22.86 13.TP
N$7
  Top 0.305: U4.22 71.61,15.48 70.87,14.73 SD1.TP
N$8
  Top 0.305: U4.21 75.51,16.38 SD0.TP
N$9
  Top 0.305: CLK.TP 68.83,17.53 71.44,17.53 71.75,17.22 72.53,17.22 73.24,17.94 75.53,17.94 75.62,18.02 U4.20
N$10
  Top 0.305: SD3.TP 74.3,18.8 74.3,20.38 74.47,20.56 U4.18
N$11
  Top 0.305: SD2.TP 72.26,21.84 75.86,21.84 U4.17
N$21
  Top 0.305: R7.1 58.8,26.63 U8.2
N$22
  Top 0.305: R8.1 58.32,25.08 U8.1
N$32
  Top 0.305: IC1.3 51.18,7.24 51.69,6.73 X7.D+
N$33  (via drill 0.25)
  Top 0.305: v52.2,6.98 51.69,7.49 IC1.4 | X7.D- 51.05,4.73 51.05,6.1 v50.29,6.86
  Bottom 0.305: v52.2,6.98 50.42,6.98 v50.29,6.86
N$34
  Top 0.305: IC1.13 52.7,13.07 52.7,14.1 52.96,14.35 54.74,14.35 55.24,14.86 RX1.A
N$35
  Top 0.305: R15.2 RX1.C
N$36
  Top 0.305: R16.2 TX1.C
N$37
  Top 0.305: IC1.14 52.2,13.06 TX1.A
N$40
  Top 0.61: C18.1 29.08,13.02 29.08,11.56 29.17,11.47 R6.2
  Top 0.813: Q6.2 29.15,13.27 C18.1 D1.C 29.08,15.37 29.08,17.15 31.09,17.15 U12.1
N$41
  Top 1.016: R11.1 17.65,12.07 CHG1.C
N$42
  Top 0.61: U13.1 18.92,8.44 18.92,9.53 17.65,9.53 R11.2
N$43
  Top 0.61: U13.5 21.8,8.44 R14.2
N$46
  Top 0.305: IC1.16 51.18,14.1 50.67,14.61 49.15,14.61 C21.2
N$47
  Top 0.305: IC1.9 55.24,10.8 55.66,11.22 R17.1
N$48
  Top 0.406: X7.VBUS 50.39,4.98 49.66,5.72
  Top 0.813: 49.66,5.72 48.9,6.48 43.81,6.48 43.81,13.08 F4.2
N$49
  Top 0.61: Q2.1 59.56,18.62 R33.2
N$50
  Top 0.61: Q5.1 63.37,16.05 R5.2
N$110
  Top 0.406: U2.4 9.95,17.73 11.81,15.88 11.81,15.5 C23.2
N$111
  Top 0.406: U2.3 9.95,19.18 8.26,19.18 R19.1 R20.2
N$112
  Top 0.61: U2.1 8.76,21.84 8.76,24.51 C24.1
N$113
  Top 0.152: 14.32,24.48 C24.2 14.32,24.64 | 15.59,21.94 U2.8 | 15.59,27.5 D2.C | 20.19,23.21 L3.1
  Top 0.61: U2.8 16.64,21.84 16.64,22.99
  Top 1.016: 14.32,24.48 16.64,24.48 16.64,22.99 20.19,22.99 L3.1 | 14.32,24.64 15.63,24.64 D2.C
N$114
  Top 0.61: U2.6 19.43,19.3 C28.2 C27.2
N$115
  Top 0.406: C27.1 21.8,17.52 R21.2
N$116
  Top 0.152: 15.75,15.27 R23.2 15.59,15.27 | 17.65,15.27 R22.1 | 15.59,17.97 U2.5
  Top 0.61: 17.65,15.27 15.62,15.27 R23.2 | 15.59,15.27 15.7,15.27 U2.5
RESET
  Top 0.305: Q2.3 60.58,21.72 60.83,21.97 61.34,21.97 62.1,22.73 62.1,25.53 63.88,27.3 72.14,27.3 74.68,29.84 85.6,29.84 86.11,29.34 91.58,29.34 U4.3
  Top 0.406: R13.2 60.58,21.59 60.58,21.72
RTS  (via drill 0.25 pad 0.25)
  Top 0.305: Q2.2 62.36,19.51 v62.36,20.96 | v47.12,12.83 47.14,12.3 IC1.19
  Top 0.61: Q2.2 62.36,19.52 R5.1
  Bottom 0.305: v62.36,20.96 53.98,12.83 v47.12,12.83
RXD  (via drill 0.25 pad 0.25)
  Top 0.305: v61.85,11.3 61.85,8.76 62.36,8.26 73.53,8.26 73.53,3.18 89.15,3.18 89.15,9.31 U4.34 | v46.1,10.8 46.36,11.3 IC1.21
  Bottom 0.305: v61.85,11.3 58.04,11.3 56.26,9.53 46.1,9.53 v46.1,10.8
SCK  (via drill 0.35)
  Top 0.305: 82.68,6.89 82.68,6.6 | 82.68,6.6 v82.68,6.48 | U4.29 arc90 82.68,9.4 82.68,6.6
  Bottom 0.305: 82.23,4.38 82.36,4.51 82.36,6.03 82.68,6.35 v82.68,6.48 | J6.3 65.79,2.41 66.04,2.16 80.01,2.16 82.23,4.38 | 82.23,4.38 82.04,4.19
SCL  (via drill 0.25 pad 0.25)
  Top 0.305: U8.10 58.32,32.11 v57.28,33.15 57.15,33.02 57.15,30.61 56.39,29.84 52.96,29.84 R10.1 | v88.27,24 91.58,24 U4.36
  Bottom 0.305: v57.28,33.15 80.64,33.15 80.9,32.89 80.9,24 v88.27,24 88.27,22.48 53.21,22.48 43.31,12.57 43.31,12.07 37.47,6.22 37.47,6.02 J1.2
SDA  (via drill 0.25 pad 0.25, 0.35)
  Top 0.305: v58.55,34.16 58.8,33.91 U8.9 58.8,30.44 R12.1 | v92.84,6.6 92.85,6.6 U4.37
  Bottom 0.305: v58.55,34.16 81.92,34.16 82.17,33.91 82.17,25.27 90.04,25.27 90.04,23.88 90.04,21.08 | 90.04,21.08 90.04,20.96 80.64,20.96 79.88,21.72 53.72,21.72 44.32,12.32 44.32,8.91 J1.1 | 90.04,21.08 92.84,21.08 v92.84,6.6
T1+
  Top 0.254: U7.3 46.1,26.8 45.85,27.05 45.09,27.05 45.15,27.12 C16.1 45.15,29.02 45.34,29.34 47.12,29.34 47.12,31.62 47.62,32.13 54.3,32.13 FB3.2
T2-
  Top 0.254: U7.2 46.61,26.8 47.05,27.24 C16.2 47.3,28.32 50.42,28.32 FB4.2
T3+
  Top 0.254: U1.3 41.27,26.8 39.24,26.8 39.31,26.86 C1.1 38.48,28.89 38.48,32.13 43.56,32.13 44,31.69 FB1.2
T4-
  Top 0.254: FB2.2 41.21,30.23 C1.2 41.77,27.5 U1.2
T5+
  Top 0.254: U3.3 36.45,26.8 36.26,27.56 C2.1 33.59,27.56 35.43,27.56 FB5.2
T6-
  Top 0.254: FB6.2 31.37,30.67 31.37,29.59 31.56,29.53 C2.2 33.66,29.53 33.66,32.13 36.96,32.13 36.95,32.12 U3.2
T7+
  Top 0.254: U5.3 31.62,26.8 31.12,27.3 25.78,27.3 25.59,27.62 C3.1 25.59,30.61 FB7.2
T8-
  Top 0.254: U5.2 32.13,27.05 30.61,28.58 C3.2 27.56,28.64 27.56,31.62 17.02,31.62 17.02,30.8 FB8.2
TC1+
  Top 0.152: 55.44,33.53 55.28,33.37 FB3.1 | 55.44,40.51 J5.1
  Top 0.305: 55.44,40.51 55.24,40.32 FB3.1
TC1-
  Top 0.152: 50.51,33.69 FB4.1 | 50.51,40.51 J5.2
  Top 0.305: J5.2 50.51,40.47 50.51,33.69
TC2+
  Top 0.152: 45.43,33.69 FB1.1 | 45.43,40.51 J5.3
  Top 0.305: J5.3 45.34,40.38 FB1.1
TC2-
  Top 0.152: 40.35,33.21 FB2.1 | 40.35,40.51 J5.4
  Top 0.305: J5.4 40.26,40.3 FB2.1
TC3+
  Top 0.152: 35.43,40.51 J5.5
  Top 0.305: J5.5 35.43,40.47 FB5.1
TC3-
  Top 0.152: 30.51,33.53 30.83,33.21 FB6.1 | 30.51,40.51 J5.6
  Top 0.305: J5.6 30.86,40.12 FB6.1
TC4+
  Top 0.254: J5.7 25.53,40.46 FB7.1
TC4-
  Top 0.254: J5.8 20.32,40.36 20.32,38.54 FB8.1
TM1  (via drill 0.25 pad 0.25)
  Top 0.152: 96.71,40.51 J3.1
  Top 0.305: 96.71,40.51 96.9,40.32 | U8.4 59.82,26.29 61.85,26.29 61.85,27.05 63.97,29.59 68.58,29.59 69.34,30.35 86.74,30.35 86.81,30.42 86.93,30.29 v87,30.35 | J3.1 96.62,36.07 95.76,36.07 v95.76,34.04 95.76,31.84 R2.2
  Bottom 0.305: v87,30.35 88.84,30.35 93.2,34.04 v95.76,34.04
TM2  (via drill 0.25 pad 0.25)
  Top 0.152: 86.55,33.02 R1.2 | 86.55,40.51 J3.3
  Top 0.305: 86.55,40.51 86.49,40.45 R1.2 85.23,33.49 v84.96,34.54 | U8.5 63.25,30.35 68.2,30.35 68.2,30.86 82.3,30.86 82.87,31.43 82.93,31.5 v82.93,32.13
  Bottom 0.305: v84.96,34.54 84.96,32.39 84.71,32.13 v82.93,32.13
TM3
  Top 0.152: 76.71,33.24 R3.2 | 76.71,40.51 J3.5
  Top 0.305: 76.71,40.51 76.58,40.39 R3.2 75.73,32.64 65.91,32.64 65.15,32.89 60.33,32.89 60.3,32.87 U8.6
TM4
  Top 0.305: J3.7 66.62,33.54 R4.2 66.42,33.66 59.82,33.66 U8.7
TXD  (via drill 0.25 pad 0.25)
  Top 0.305: v61.09,10.29 61.34,10.03 61.34,8.51 62.1,7.75 72.52,7.75 72.77,7.49 72.77,2.54 90.31,2.54 U4.35 | IC1.20 46.37,11.8 v46.1,12.07
  Bottom 0.305: v61.09,10.29 58.29,10.29 56.77,8.76 45.34,8.76 45.34,11.81 45.59,12.07 v46.1,12.07
VBAT
  Top 0.152: 18.33,4.32 18.29,4.32 18.29,4.7 | 17.91,6.22 18.29,6.22 18.29,6.48
  Top 0.305: 17.91,4.68 18.33,4.68 18.33,4.32 R18.2
  Top 0.61: U13.3 19.15,6.48 18.29,6.48 15.88,6.48 C31.1
  Top 0.813: 17.91,6.29 17.91,6.22 17.91,4.7 18.29,4.7 25.27,4.7 Q6.3
  Top 1.016: C31.1 14.92,6.1 12.07,6.1 X10.2
VBUS  (via drill 0.35, 0.5 pad 0.25)
  Top 0.152: 21.78,6.54 U13.4 | 21.78,11.94 CHG1.A 21.78,12.1 | L3.2 20.19,25.91 | 24.48,25.91 C26.2 | 19.08,29.56 C25.2
  Top 0.254: 56.52,16.89 46.04,16.89
  Top 0.305: Q6.1 26.22,11.37 26.22,15.37 | IC1.8 IC1.7 55.27,9.8 56.52,11.05 56.52,16.89 | 46.04,16.89 45.18,16.03
  Top 0.61: R22.2 21.75,13.5 CHG1.A | 21.78,11.94 24.26,11.94 24.26,6.73 21.75,6.73 U13.4 | v45.34,8 45.34,15.88 45.18,16.03 F4.1 | v54.23,6.98 55.12,6.1 58.54,6.1 60.45,4.18 62.37,6.1 J6.2
  Top 0.813: 19.08,29.56 19.18,29.56 19.18,26.54 20.19,26.54 L3.2 | 20.19,25.91 24.64,25.91 C26.2 | D1.A 26.22,15.37 | R9.2 25.46,17.4 D1.A | D1.A 23.5,15.37 TP15.TP 23.5,13.84 22.99,13.84 22.99,11.94 21.78,11.94
  Top 1.016: C26.2 24.51,25.78 24.51,18.67 | 24.51,18.67 24.51,17.4 R9.2 | F4.1 43.05,18.67 24.51,18.67
  Bottom 0.61: v54.23,6.98 53.98,7.49 53.98,8 v45.34,8
VIN
  Top 0.152: 8.13,13.37 R19.2 | 6.22,16.07 C8.2
  Top 0.61: U2.2 6.99,20.57 6.61,20.19 | 6.22,16.07 6.22,13.59 6.48,13.34 8.17,13.34 R19.2
  Top 1.016: C8.2 6.61,20.19 C9.2 C22.2 6.73,26.92 6.73,37.54 J2.1

### Text on the board
tNames: GND | TC4- | TC4+ | TC3- | TC3+ | TC2- | TC2+ | TC1- | TC1+ | TM4 | TM3 | TM2 | TM1 | BBQ MASTER | GND | 5v
bNames: 3v3 | GND | SCL | SDA